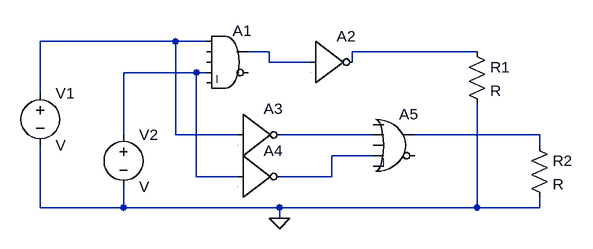
[diagram p0: schematic 302.asc]
302.asc, the LTspice schematic file:
Version 4
SHEET 1 880 680
WIRE 144 16 -64 16
WIRE 192 16 144 16
WIRE 288 32 256 32
WIRE 608 32 416 32
WIRE 288 48 288 32
WIRE 352 48 288 48
WIRE 416 48 416 32
WIRE 176 64 64 64
WIRE 192 64 176 64
WIRE -64 96 -64 16
WIRE 64 160 64 64
WIRE 144 160 144 16
WIRE 240 160 144 160
WIRE 448 160 304 160
WIRE 704 160 512 160
WIRE 704 176 704 160
WIRE 448 192 384 192
WIRE 176 224 176 64
WIRE 240 224 176 224
WIRE 384 224 384 192
WIRE 384 224 304 224
WIRE -64 272 -64 176
WIRE 64 272 64 240
WIRE 64 272 -64 272
WIRE 304 272 64 272
WIRE 608 272 608 112
WIRE 608 272 304 272
WIRE 704 272 704 256
WIRE 704 272 608 272
WIRE 304 288 304 272
FLAG 304 288 0
SYMBOL voltage -64 80 R0
SYMATTR InstName V1
SYMBOL voltage 64 144 R0
SYMATTR InstName V2
SYMBOL Digital\\and 224 -16 R0
SYMATTR InstName A1
SYMBOL Digital\\inv 352 -16 R0
SYMATTR InstName A2
SYMBOL Digital\\inv 240 96 R0
SYMATTR InstName A3
SYMBOL Digital\\inv 240 160 R0
SYMATTR InstName A4
SYMBOL Digital\\or 480 112 R0
SYMATTR InstName A5
SYMBOL res 592 16 R0
SYMATTR InstName R1
SYMBOL res 688 160 R0
SYMATTR InstName R2

The netlist it stands for:
* 302.asc
V1 N001 0 V
V2 N004 0 V
A1 N001 0 0 N004 0 0 N002 0 AND
A2 N002 0 0 0 0 N003 0 0 BUF
A3 N001 0 0 0 0 N005 0 0 BUF
A4 N004 0 0 0 0 N007 0 0 BUF
A5 0 N005 0 N007 0 0 N006 0 OR
R1 N003 0 R
R2 N006 0 R
.backanno
.end